# EAGLE design ZeroGecko110BreakoutV1 (EAGLE 6.4)
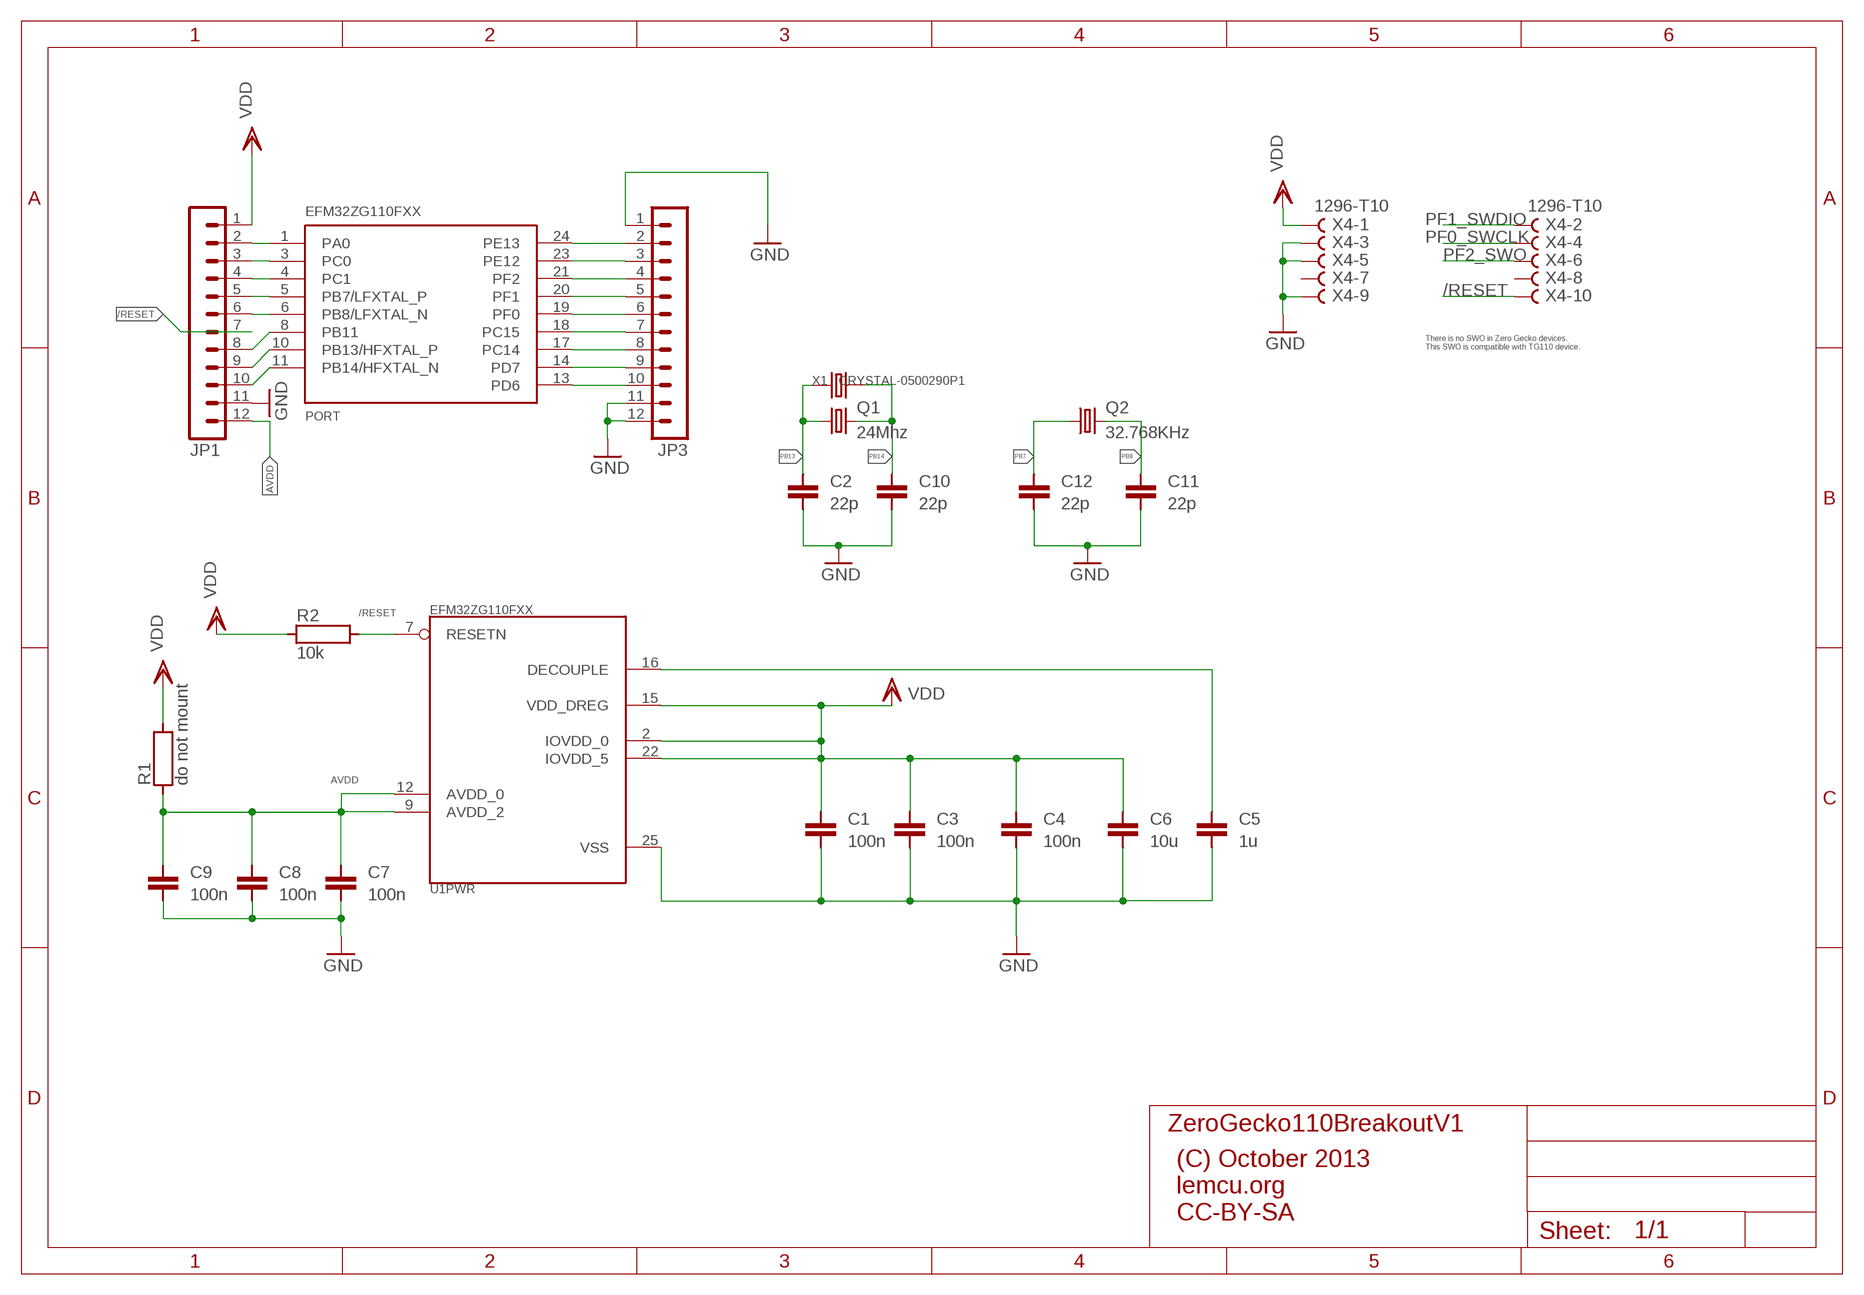
[diagram p0: schematic, sheet 1]

## Parts
C1  100n  C0603  [C0603]
C2  22p  C0603  [C0603]
C3  100n  C0603  [C0603]
C4  100n  C0603  [C0603]
C5  1u  C0805  [C0805]
C6  10u  C0805  [C0805]
C7  100n  C0603  [C0603]
C8  100n  C0603  [C0603]
C9  100n  C0603  [C0603]
C10  22p  C0603  [C0603]
C11  22p  C0603  [C0603]
C12  22p  C0603  [C0603]
JP1  MA12-1  [MA12-1]
JP3  MA12-1  [MA12-1]
Q1  24Mhz  CRYSTALHC49U-V  [HC49U-V]
Q2  32.768KHz  CRYSTALTC26V  [TC26V]
R1  do not mount  R0805  [R0805]
R2  10k  R0603  [R0603]
U1  EFM32ZG110FXX  [QFN24]
X1  CRYSTAL-0500290P1  [2P-SMD-5.0X3.2]
X4  1296-T10  [1296-10]

## Nets
/RESET: JP1.7 R2.2 U1.7(PWR:RESETN) X4.10
AVDD: C7.2 C8.2 C9.2 JP1.12 R1.1 U1.9(PWR:AVDD_2) U1.12(PWR:AVDD_0)
GND: C1.1 C2.1 C3.1 C4.1 C5.1 C6.1 C7.1 C8.1 C9.1 C10.1 C11.1 C12.1 JP1.11 JP3.1 JP3.11 JP3.12 U1.25(PWR:VSS) X4.3 X4.5 X4.9
N$24: C5.2 U1.16(PWR:DECOUPLE)
PA0: JP1.2 U1.1(A:PA0)
PB7: C12.2 JP1.5 Q2.1 U1.5(A:PB7/LFXTAL_P)
PB8: C11.2 JP1.6 Q2.2 U1.6(A:PB8/LFXTAL_N)
PB11: JP1.8 U1.8(A:PB11)
PB13: C2.2 JP1.9 Q1.1 U1.10(A:PB13/HFXTAL_P) X1.1
PB14: C10.2 JP1.10 Q1.2 U1.11(A:PB14/HFXTAL_N) X1.2
PC0: JP1.3 U1.3(A:PC0)
PC1: JP1.4 U1.4(A:PC1)
PC14: JP3.8 U1.17(A:PC14)
PC15: JP3.7 U1.18(A:PC15)
PD6: JP3.10 U1.13(A:PD6)
PD7: JP3.9 U1.14(A:PD7)
PE12: JP3.3 U1.23(A:PE12)
PE13: JP3.2 U1.24(A:PE13)
PF0_SWCLK: JP3.6 U1.19(A:PF0) X4.4
PF1_SWDIO: JP3.5 U1.20(A:PF1) X4.2
PF2_SWO: JP3.4 U1.21(A:PF2) X4.6
VDD: C1.2 C3.2 C4.2 C6.2 JP1.1 R1.2 R2.1 U1.2(PWR:IOVDD_0) U1.15(PWR:VDD_DREG) U1.22(PWR:IOVDD_5) X4.1
Unconnected: X4.7 X4.8

## Notes on the sheet
- There is no SWO in Zero Gecko devices.
  This SWO is compatible with TG110 device.
- (C) October 2013
  lemcu.org
  CC-BY-SA

## Library data of the parts
C1-C12 = klib:C
JP1 JP3 = con-lstb:MA12-1: PIN HEADER; OC_FARNELL: unknown; OC_NEWARK: unknown
Q1 Q2 = crystal:CRYSTAL: CRYSTAL
R1 R2 = klib:R
U1 = ZeroGecko:EFM32ZG110FXX: EFM32ZG110FXX Zero Microcontroller in 5mm x 5mm QFN24 package
X1 = OPL Eagle Library:CRYSTAL*
X4 = con-leotronics:1296-T10: 1.27mm SINGLE ROW FEMALE SOCKET Source: http://www.leotronics.co.uk/Conexcon/Data%20Sheets/sec.%20A/1296ing.pdf

## Board
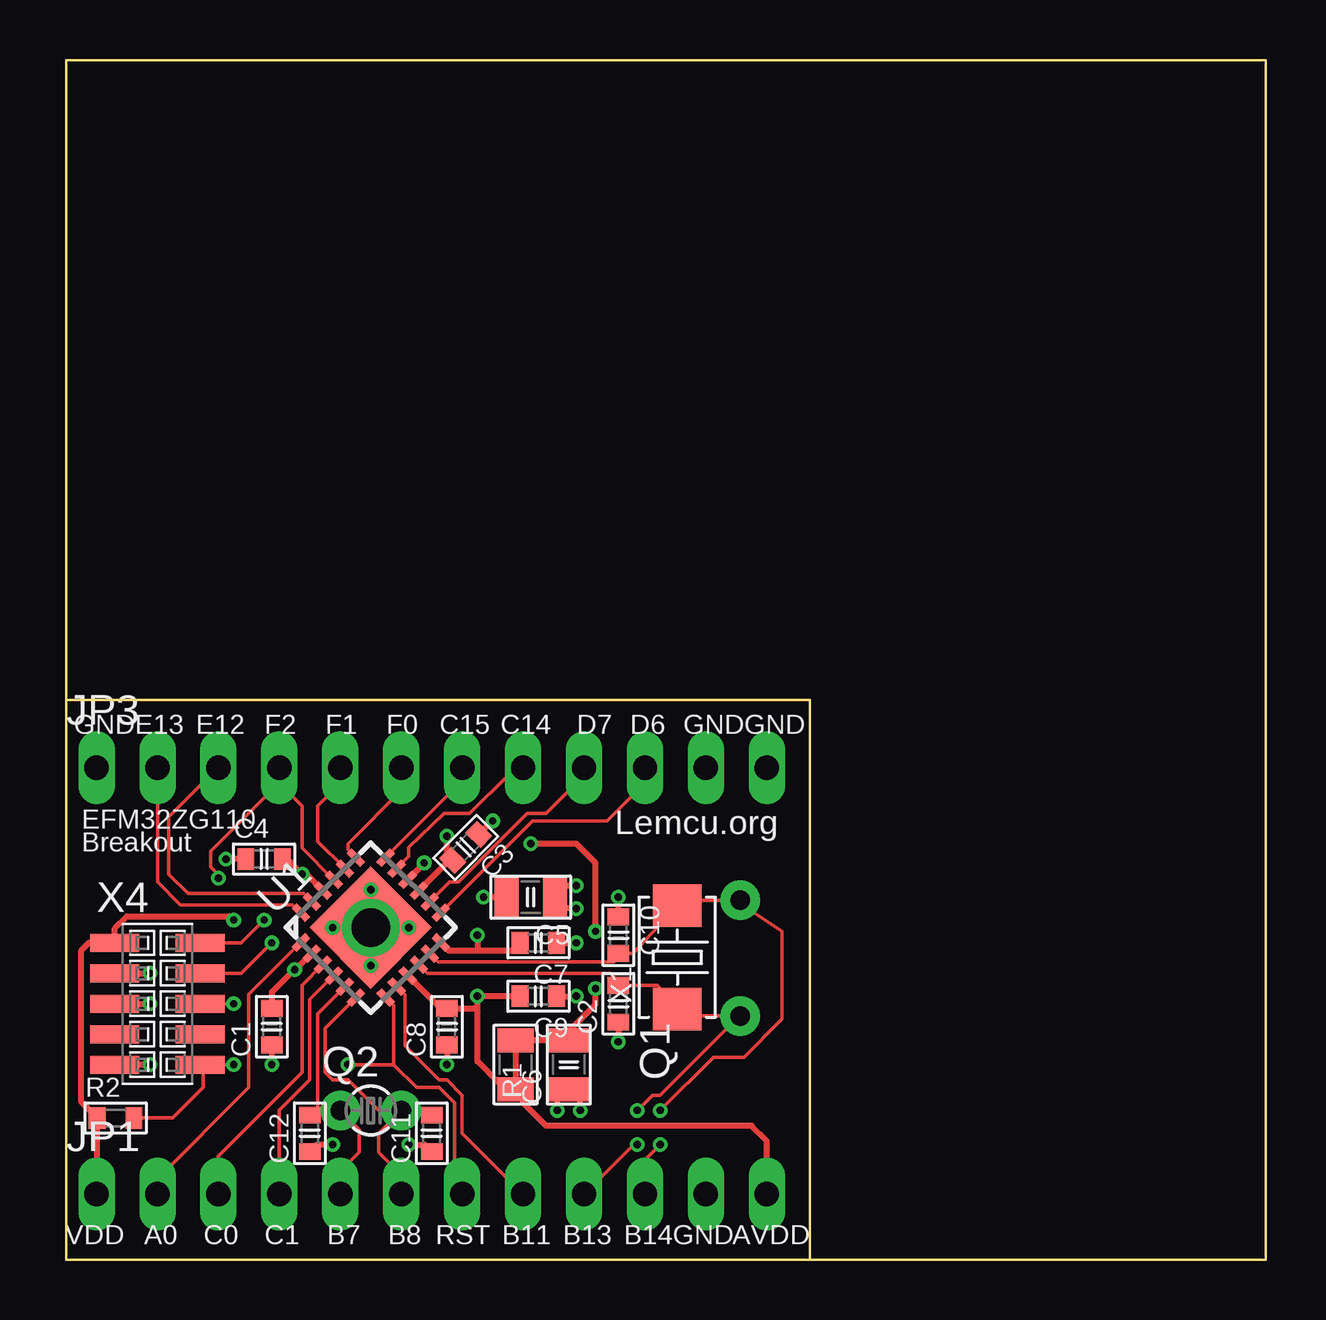
[diagram p1: board, top side]
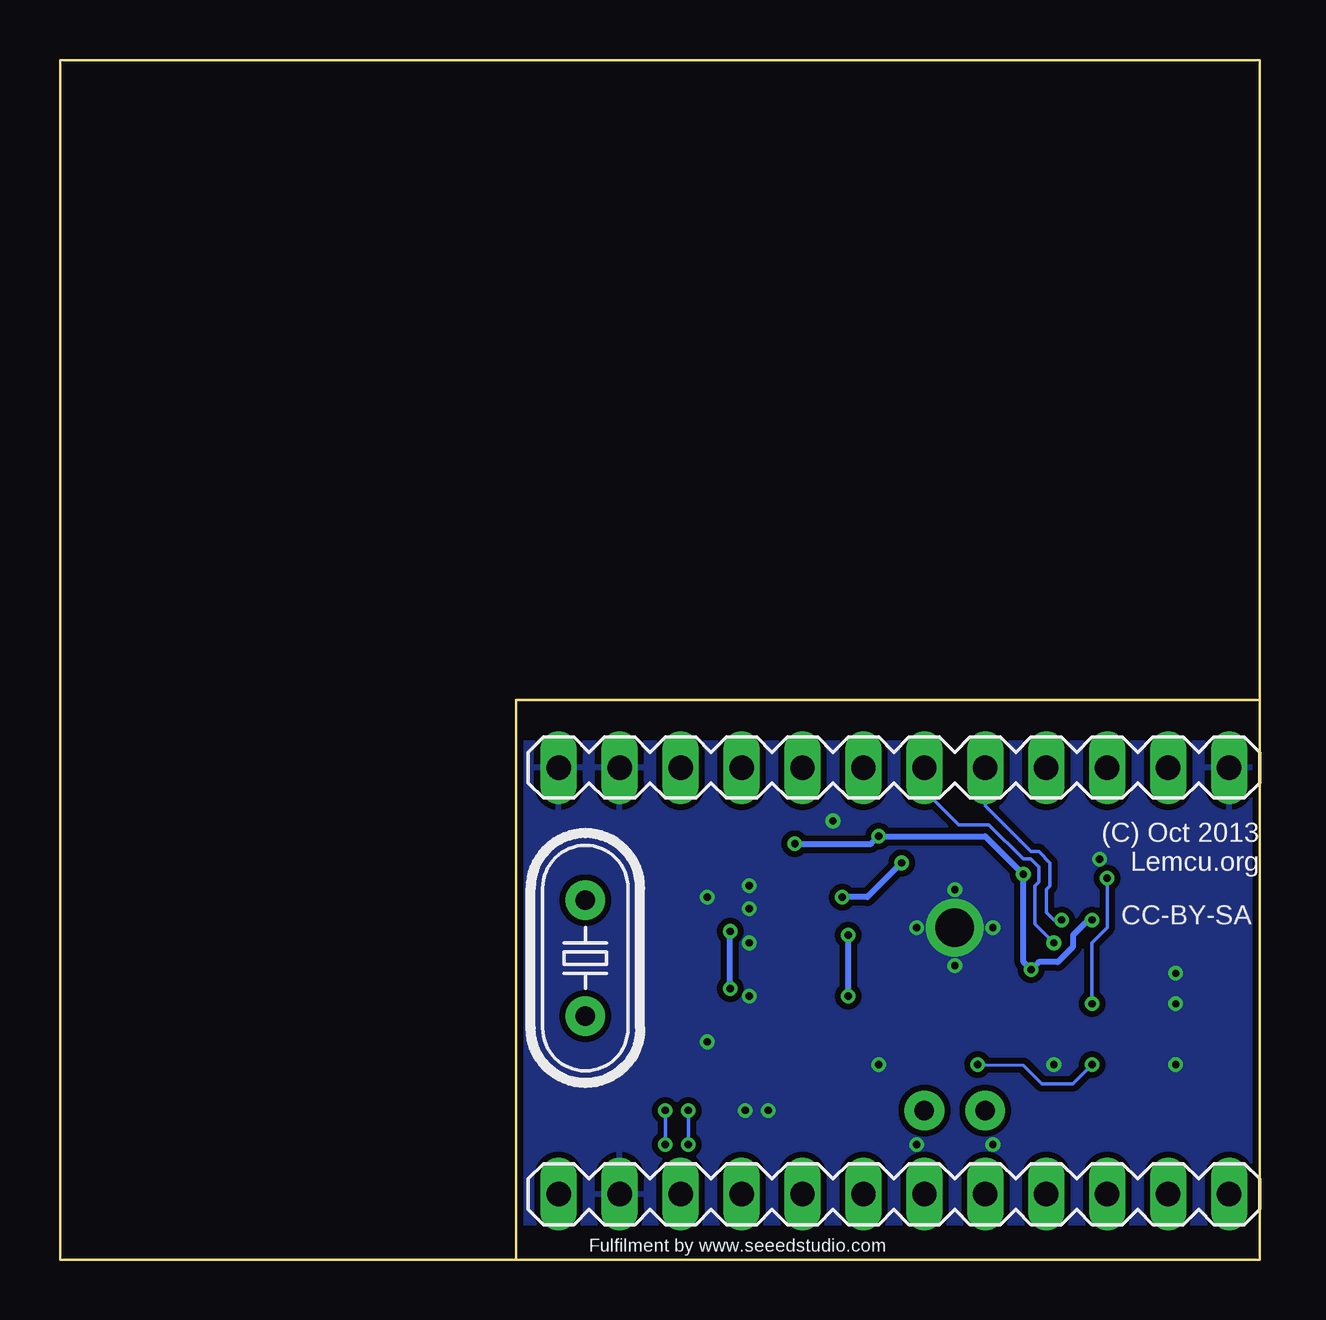
[diagram p2: board, bottom side, seen from below]

Size 50 x 50 mm. Coordinates in mm from the lower left corner, seen from the top.
Outline: 0,23.32 0,0 31,0
Outline: 0,23.32 31,23.32 31,0
Outline: 0,23.32 0,50 50,50 50,0 31,0
Copper layers (1*16): Top 0.035mm / dielectric 0.2mm / Bottom 0.035mm
Design rules "default": minimum track width 6mil, minimum drill 12mil, track to track 6mil, track to pad 6mil, pad to pad 6mil, via to via 6mil, smd to smd 0mil, copper to edge 10mil, drill to drill 10mil, minimum pad ring 6mil, minimum via ring 6mil, stop-mask expansion 2mil, vias tented up to drill 0.35mm, thermal gap 10mil

### Footprints (pad centres in the part's own frame; a part is rotated, then mirrored left to right if it is on the bottom)
C0603 = smd 0.7 x 0.9: 1 -0.762,0; 2 0.762,0
C0805 = smd 1 x 1.7: 1 -1.016,0; 2 1.016,0
MA12-1 = drill 1.016 long: 1 -13.97,0; 2 -11.43,0; 3 -8.89,0; 4 -6.35,0; 5 -3.81,0; 6 -1.27,0; 7 1.27,0; 8 3.81,0; 9 6.35,0; 10 8.89,0; 11 11.43,0; 12 13.97,0
HC49U-V = drill 0.813 pad 1.651: 1 -2.413,0; 2 2.413,0
TC26V = drill 0.813 pad 1.651: 1 -1.27,0; 2 1.27,0
R0805 = smd 1 x 1.5: 1 -1.016,0; 2 1.016,0
R0603 = smd 0.7 x 0.9: 1 -0.762,0; 2 0.762,0
QFN24 = smd 0.8 x 0.3: 1 -2.5,1.625; 2 -2.5,0.975; 3 -2.5,0.325; 4 -2.5,-0.325; 5 -2.5,-0.975; 6 -2.5,-1.625; 13 2.5,-1.625; 14 2.5,-0.975; 15 2.5,-0.325; 16 2.5,0.325; 17 2.5,0.975; 18 2.5,1.625 | smd 0.3 x 0.8: 7 -1.625,-2.5; 8 -0.975,-2.5; 9 -0.325,-2.5; 10 0.325,-2.5; 11 0.975,-2.5; 12 1.625,-2.5; 19 1.625,2.5; 20 0.975,2.5; 21 0.325,2.5; 22 -0.325,2.5; 23 -0.975,2.5; 24 -1.625,2.5 | smd 3.6 x 3.6: 25 0,0
2P-SMD-5.0X3.2 = smd 1.778 x 2.032: 1 -2.159,0; 2 2.159,0
1296-10 = smd 0.76 x 2.05: 1 -2.54,-1.78; 2 -2.54,1.78; 3 -1.27,-1.78; 4 -1.27,1.78; 5 0,-1.78; 6 0,1.78; 7 1.27,-1.78; 8 1.27,1.78; 9 2.54,-1.78; 10 2.54,1.78

### Placement (x,y rotation side)
C1  8.57,9.71 90 top
C2  23.02,10.66 90 top
C3  16.66,17.18 225 top
C4  8.26,16.69 0 top
C5  19.37,15.11 180 top
C6  20.95,8.12 90 top
C7  19.68,13.2 180 top
C8  15.88,9.71 90 top
C9  19.68,10.98 180 top
C10  23.02,13.52 270 top
C11  15.24,5.26 90 top
C12  10.16,5.26 90 top
JP1  15.24,2.72 0 top
JP3  15.24,20.5 0 top
Q1  28.1,12.56 90 top
Q2  12.7,6.21 0 top
R1  18.73,8.12 90 top
R2  2.06,5.9 0 top
U1  12.7,13.84 45 top
X1  25.48,12.6 90 top
X4  3.81,10.66 270 top

### Tracks (layer width: path | path; a pad name or v marks a point on that pad's centre or on a via)
/RESET  (via drill 0.3)
  Top 0.155: U1.7 13.65,10.58 13.65,8.12 | 13.65,8.12 14.61,7.17 15.56,7.17 16.19,6.53 16.19,3.04 JP1.7 | R2.2 4.45,5.9 5.71,7.17 5.71,8 | 5.71,8 X4.10 | 5.71,8 5.84,8.12 v6.99,8.12 | v11.75,8.12 13.65,8.12
  Bottom 0.155: v6.99,8.12 7.78,7.33 9.07,7.33 9.84,8.1 v11.75,8.12
AVDD  (via drill 0.3)
  Top 0.254: JP1.12 29.21,4.95 28.57,5.58 20,5.58 19.05,6.53 19.05,6.79 R1.1 19.05,7.1 19.05,7.17 18.41,7.17 18.1,7.3 17.14,8.26 17.14,9.71 17.14,10.34 | U1.9 15.61,10.47 C8.2 17.02,10.47 arc-90 17.14,10.34 | U1.12 15.95,12.88 17.14,12.88 | 17.14,12.88 18.61,12.88 arc90 C7.2 | 17.14,10.34 v17.14,10.98 C9.2 | v17.14,13.52 17.14,12.88
  Bottom 0.254: v17.14,10.98 v17.14,13.52
GND  (via drill 0.3, 1.6)
  Top 0.254: 21.27,15.74 v21.27,15.58 20.38,15.58 C5.1 | v21.27,14.63 20.32,14.63 | v21.43,6.21 21.43,6.85 20.95,6.85 | v20.48,6.21 20.48,6.85 20.95,6.85 | 20.95,6.85 C6.1 | C8.1 v15.88,8.12 | C9.1 v21.27,10.98 | C7.1 v21.27,13.2 | 8.57,9.07 C1.1 v8.57,8.12 | v3.49,8.12 X4.9 | X4.5 v3.49,10.66 | X4.3 v3.49,11.93 | v11.11,4.79 10.45,4.79 C12.1 | v14.29,4.79 14.95,4.79 C11.1 | C10.1 v23.02,15.11 | C2.1 v23.02,9.07 | C3.1 17.76,18.28 v17.78,18.28 | C4.1 v6.67,16.69
  other vias: 12.7,13.84 12.7,15.42 12.7,12.25 14.29,13.84 11.11,13.84
  pour Bottom (isolate 0.25): 0,21.57 30.96,21.57 30.96,1.5 0,1.5
N$24  (via drill 0.3)
  Top 0.155: 14.92,16.52 v14.92,16.53
  Top 0.254: U1.16 14.92,16.52 | v17.4,15.11 C5.2
  Bottom 0.254: v14.92,16.53 16.35,15.11 v17.4,15.11
PA0
  Top 0.155: U1.1 7.62,11.05 7.62,7.17 3.81,3.36 JP1.2
PB7
  Top 0.155: 10.16,6.21 Q2.1 12.22,5.42 12.22,4.47 11.43,3.67 JP1.5 | U1.5 10.48,10.23 10.48,6.21 10.16,5.9 C12.2
  Top 0.254: 10.16,6.21 C12.2
PB8
  Top 0.155: Q2.2 15.24,6.21 | U1.6 10.79,9.63 10.79,7.8 11.11,7.49 11.75,7.49 13.02,6.21 Q2.2 | JP1.6 13.97,3.52 13.02,4.47 13.02,5.26 Q2.2
  Top 0.254: 15.24,6.21 C11.2
PB11
  Top 0.155: U1.8 14.13,11.03 14.13,8.91 15.56,7.49 15.88,7.49 16.51,6.85 16.51,5.26 JP1.8
PB13  (via drill 0.3)
  Top 0.155: U1.10 15.06,11.93 22.7,11.93 23.18,11.45 C2.2 24.65,11.42 X1.1 25.92,10.15 Q1.1 27.94,10.03 24.77,6.85 24.45,6.85 v23.81,6.21 | JP1.9 23.65,4.79 v23.81,4.79
  Bottom 0.155: v23.81,4.79 v23.81,6.21
PB14  (via drill 0.3)
  Top 0.155: U1.11 15.51,12.41 22.83,12.41 C10.2 23.64,12.76 X1.2 25.86,14.98 Q1.2 27.94,14.95 29.84,13.68 29.84,10.03 28.26,8.44 26.99,8.44 v24.77,6.21 | JP1.10 24.13,4.15 v24.77,4.79
  Bottom 0.155: v24.77,4.79 v24.77,6.21
PC0
  Top 0.155: U1.3 9.84,11.44 9.84,7.8 6.35,4.31 JP1.3
PC1
  Top 0.155: U1.4 10.16,10.84 10.16,7.49 8.89,6.21 JP1.4
PC14
  Top 0.155: JP3.8 19.05,20.18 18.41,20.18 16.83,18.6 15.77,18.6 14.29,17.17 14.29,16.8 U1.17
PC15
  Top 0.155: U1.18 16.51,19.94 JP3.7
PD6
  Top 0.155: U1.13 19.44,18.28 22.54,18.28 24.13,19.87 JP3.10
PD7
  Top 0.155: U1.14 15.98,15.74 16.35,15.74 19.21,18.6 20,18.6 21.59,20.18 JP3.9
PE12
  Top 0.155: U1.23 9.89,15.26 5.08,15.26 4.29,16.06 4.29,18.44 JP3.3
PE13
  Top 0.155: U1.24 9.45,14.79 4.76,14.79 3.81,15.74 JP3.2
PF0_SWCLK  (via drill 0.3)
  Top 0.155: U1.19 11.75,17.09 11.75,17.33 13.97,19.55 JP3.6 | X4.4 7.3,11.93 v8.57,13.2
  Bottom 0.155: v8.57,13.2 9.37,13.99 9.37,15.58 9.21,15.74 9.21,16.38 9.53,16.69 9.84,16.69 11.27,18.12 12.54,18.12 13.97,19.55 JP3.6
PF1_SWDIO  (via drill 0.3)
  Top 0.155: U1.20 10.48,17.44 10.48,18.91 11.43,19.87 JP3.5 | X4.2 7.3,13.2 v8.26,14.15
  Bottom 0.155: v8.26,14.15 8.57,14.15 8.89,14.47 8.89,15.42 8.73,15.58 8.73,16.53 9.21,17.01 9.53,17.01 11.43,18.91 JP3.5
PF2_SWO  (via drill 0.3)
  Top 0.155: U1.21 9.84,17.15 9.84,18.91 8.89,19.87 | X4.6 v6.99,10.66 | v6.35,15.9 6.35,16.06 6.03,16.38 6.03,17.01 8.89,19.87 | 8.89,19.87 JP3.4
  Bottom 0.155: v6.99,10.66 6.99,13.2 6.35,13.84 v6.35,15.9
VDD  (via drill 0.3)
  Top 0.155: 15.97,16.64 C3.2
  Top 0.254: C1.2 8.57,11.14 v9.53,12.09 9.57,12.09 U1.2 | 15.97,16.64 U1.15 16.02,16.69 16.19,16.69 15.88,17.01 v15.88,17.64 | U1.22 10.02,16.06 v9.84,16.06 9.21,16.69 C4.2 | JP1.1 1.3,2.75 R2.1 0.64,6.56 0.64,12.88 0.95,13.2 X4.1 2.03,13.8 2.54,14.31 6.83,14.31 v6.99,14.15 | 20.95,9.07 C6.2 | C6.2 20.95,9.53 22.07,10.64 v22.07,11.29 | v22.07,13.68 22.07,16.53 21.27,17.33 v19.37,17.33 | C6.2 R1.2 18.73,6.99
  Bottom 0.254: v6.99,14.15 7.14,14.15 7.78,13.52 7.78,13.04 8.41,12.41 9.21,12.41 v9.53,12.09 9.84,12.41 v9.84,16.06 11.43,17.64 v15.88,17.64 16.19,17.33 v19.37,17.33 | v22.07,11.29 v22.07,13.68

### Text on the board
tPlace: GND | E13 | E12 | F2 | F1 | F0 | C15 | C14 | D7 | D6 | GND | GND | Lemcu.org | EFM32ZG110 | Breakout | VDD | A0 | C0 | C1 | B7 | B8 | RST | B11 | B13 | B14 | GND | AVDD
bPlace: (C) Oct 2013 / Lemcu.org | CC-BY-SA | Fulfilment by www.seeedstudio.com